# Altium schematic sheet 5V_3A.schdoc
size 345 x 130 mm; SheetNumber: 1; SheetTotal: 1
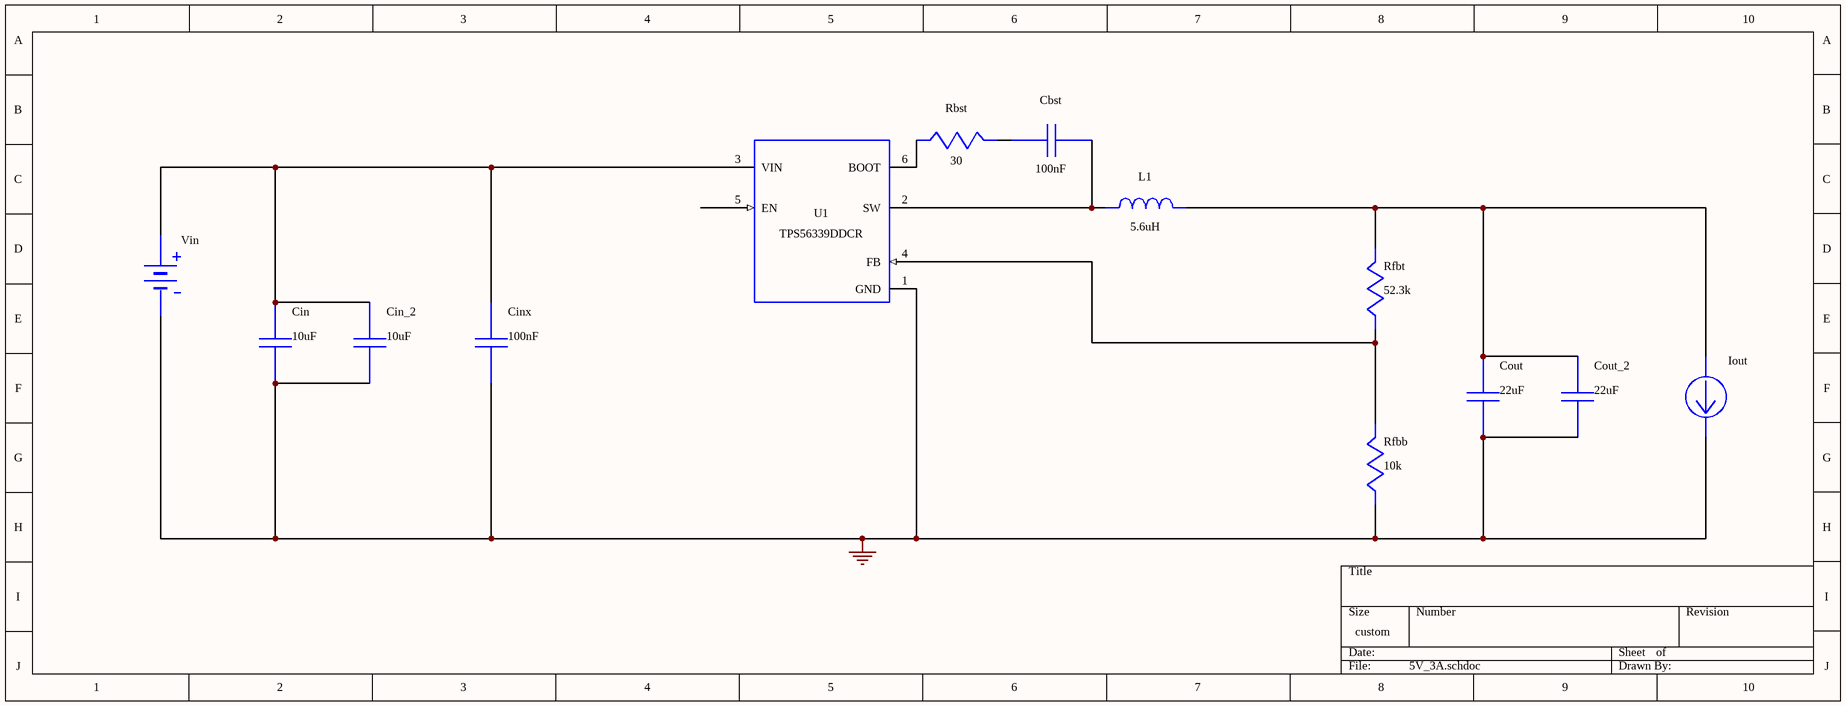
[diagram p0: 5V_3A.schdoc]

## Parts
Cbst  value 100nF  (hidden comment: C0805C104M5RACTU)
Cin  value 10uF  (hidden comment: GRM21BR61E106MA73L)
Cin_2  value 10uF  (hidden comment: GRM21BR61E106MA73L)
Cinx  value 100nF  (hidden comment: C0805C104M5RACTU)
Cout  value 22uF  (hidden comment: C2012X7S1A226M125AC)
Cout_2  value 22uF  (hidden comment: C2012X7S1A226M125AC)
Iout  WB_CURRENT_LOAD  (value not drawn)
L1  value 5.6uH  (hidden comment: SRP6540-5R6M)
Rbst  value 30  (hidden comment: RC0603FR-0730RL)
Rfbb  value 10k  (hidden comment: CRCW060310K0FKEA)
Rfbt  value 52.3k  (hidden comment: CRCW060352K3FKEA)
U1  TPS56339DDCR
Vin  WB_BATTERY  (value not drawn)

## Nets
0: Cin.2 Cin_2.2 Cinx.2 Cout.2 Cout_2.2 Iout.2(-) Rfbb.2 U1.1(GND) Vin.2(-)
NetCbst_1: Cbst.1 Rbst.1
NetCbst_2: Cbst.2 L1.2 U1.2(SW)
NetCin_1: Cin.1 Cin_2.1 Cinx.1 U1.3(VIN) Vin.1(+)
NetCout_1: Cout.1 Cout_2.1 Iout.1(+) L1.1 Rfbt.1
NetRbst_2: Rbst.2 U1.6(BOOT)
NetRfbb_1: Rfbb.1 Rfbt.2 U1.4(FB)

Not connected (* = marked no-connect by the designer): U1 5(EN)

## Library data of the parts
Cbst Cinx = C0805C104M5RACTU: Manufacturer Name: Kemet; PackageReference: C0805C104M5RACTU; Manufacturer Part Number: C0805C104M5RACTU
Cin Cin_2 = GRM21BR61E106MA73L: GRM21BR61E106MA7; Manufacturer Name: MuRata; PackageReference: GRM21BR61E106MA73L; Manufacturer Part Number: GRM21BR61E106MA73L
Cout Cout_2 = C2012X7S1A226M125AC: C2012X7S1A226M12; Manufacturer Name: TDK; PackageReference: C2012X7S1A226M125AC; Manufacturer Part Number: C2012X7S1A226M125AC
L1 = SRP6540-5R6M: Unknown; Manufacturer Name: Bourns; PackageReference: SRP6540-5R6M; Manufacturer Part Number: SRP6540-5R6M
Rbst = RC0603FR-0730RL: Manufacturer Name: Yageo; PackageReference: RC0603FR-0730RL; Manufacturer Part Number: RC0603FR-0730RL
Rfbb = CRCW060310K0FKEA: Manufacturer Name: Vishay-Dale; PackageReference: CRCW060310K0FKEA; Manufacturer Part Number: CRCW060310K0FKEA
Rfbt = CRCW060352K3FKEA: Manufacturer Name: Vishay-Dale; PackageReference: CRCW060352K3FKEA; Manufacturer Part Number: CRCW060352K3FKEA
U1 = TPS56339DDCR: Manufacturer Name: Texas Instruments; PackageReference: TPS56339DDCR; Manufacturer Part Number: TPS56339DDCR; Value: N/A
Iout = WB_CURRENT_LOAD: PackageReference: WB_CURRENT_LOAD; Manufacturer Part Number: WB_CURRENT_LOAD; Manufacturer Name: WB_CURRENT_LOAD; Value: N/A
Vin = WB_BATTERY: PackageReference: WB_BATTERY; Manufacturer Part Number: WB_BATTERY; Manufacturer Name: WB_BATTERY; Value: N/A